# Altium schematic sheet ADC.SchDoc
size A; SheetNumber: 4; SheetTotal: 4
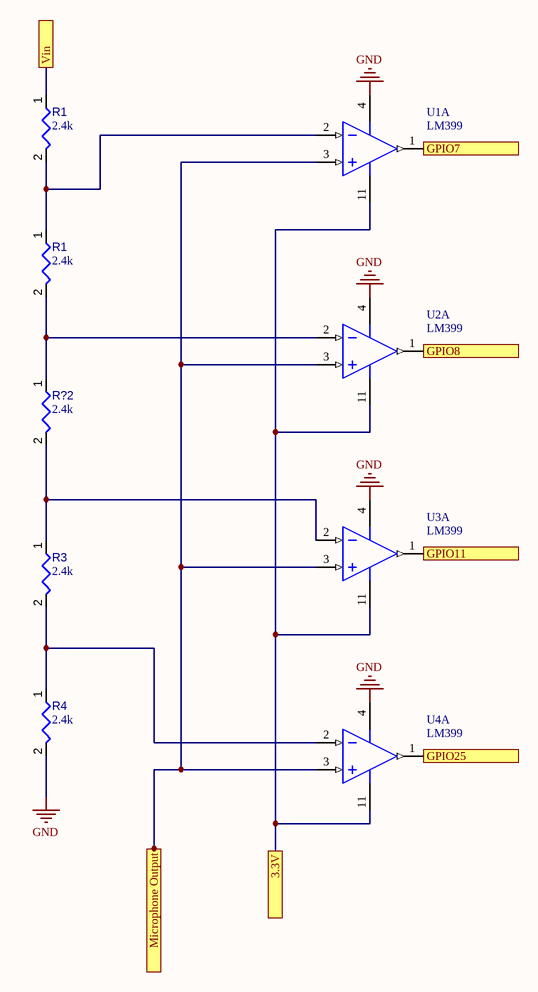
[diagram p0: ADC.SchDoc]

## Parts
(Parts that share a designator on the sheet are numbered #1, #2 ... from top to bottom, then left to right.)
R1#1  value 2.4k  [RESC1608X55X25ML10T15]  (hidden comment: Resistor 10k +/-1% 0603 100 mW)
R1#2  value 2.4k  [RESC1608X55X25ML10T15]  (hidden comment: Resistor 10k +/-1% 0603 100 mW)
R3  value 2.4k  [RESC1608X55X25ML10T15]  (hidden comment: Resistor 10k +/-1% 0603 100 mW)
R4  value 2.4k  [RESC1608X55X25ML10T15]  (hidden comment: Resistor 10k +/-1% 0603 100 mW)
R?2  value 2.4k  [RESC1608X55X25ML10T15]  (hidden comment: Resistor 10k +/-1% 0603 100 mW)
U1  LM399  [N0014A]  (part A of 4)
U2  LM399  [N0014A]  (part A of 4)
U3  LM399  [N0014A]  (part A of 4)
U4  LM399  [N0014A]  (part A of 4)

## Ports
3.3V (see Band_pass_filter_wiring_diagram[1A]), GPIO7, GPIO8, GPIO11, GPIO25, Microphone Output, Vin

## Nets
GND: R4.2 U1.4(VCC+) U2.4(VCC+) U3.4(VCC+) U4.4(VCC+)
3.3V: U1.11(VCC-) U2.11(VCC-) U3.11(VCC-) U4.11(VCC-) ; port 3.3V
GPIO7: U1.1(OUT1) ; port GPIO7
GPIO8: U2.1(OUT1) ; port GPIO8
GPIO11: U3.1(OUT1) ; port GPIO11
GPIO25: U4.1(OUT1) ; port GPIO25
Microphone Output: U1.3(IN1+) U2.3(IN1+) U3.3(IN1+) U4.3(IN1+) ; port Microphone Output
Vin: R1#1.1 ; port Vin
NetR1#1_2: R1#1.2 R1#2.1 U1.2(IN1-)
NetR1#2_2: R1#2.2 R?2.1 U2.2(IN1-)
NetR3_1: R3.1 R?2.2 U3.2(IN1-)
NetR3_2: R3.2 R4.1 U4.2(IN1-)

## Library data of the parts
R1#1 R1#2 R3 R4 R?2 = CMP-009-00017-5: Chip Resistor, 10 KOhm, +/- 1%, 01 W, -55 to 155 degC, 0603 (1608 Metric); Voltage Rating: 50V; Power: 100mW; RoHS Compliant: True; Min Operating Temperature: -55°C; Pins: 2; Case/Package: 0603; Mounting Technology: SM; Max Operating Temperature: 155°C; Tolerance: 1%
U1-U4 = CMP-0017-00818-2: JFET-Input Operational Amplifier, 7 to 36 V, 0 to 70 degC, 14-pin DIP (N14), Pb-Free (RoHS); Manufacturer: Texas Instruments; PartNumber: TL084CN; Rating: Catalog; Iq per channel(Max)(mA): 2.8; Number of Channels: 4; IIB(Max)(pA): 400; Vio (25C)(Max)(mV): 15; GBW(Typ)(MHz): 3; Total Supply Voltage(Max)(+5V is 5, +/-5V is 10): 36; Vn at 1kHz(Typ)(nV/rtHz): 18; Sub Family: General Purpose Amplifier, High Supply Voltage Amplifier (>=30V); Slew Rate(Typ)(V/us): 13; Total Supply Voltage(Min)(+5V is 5, +/-5V is 10): 7; CMRR(Min)(dB): 70; ComponentLink3Description: Package Specification; PackageDescription: 14-Pin Plastic In-Line, Body 19.305 x 6.35 mm, Pitch 2.54 mm; ComponentLink1Description: Manufacturer URL; PackageVersion: 4040049/E, 12/2002; Eco-Plan: Pb-Free (RoHS); ComponentLink2URL: http://www.ti.com/lit/ds/symlink/tl084.pdf; ComponentLink1URL: http://www.ti.com/; DatasheetVersion: SLOS081G; Mounting Technology: Through Hole; Offset Drift(Typ)(uV/C): 18; PackageReference: N0014A; ComponentLink3URL: http://www.ti.com/lit/ml/mpdi002c/mpdi002c.pdf; ComponentLink2Description: Datasheet; Code_JEDEC: MS-001